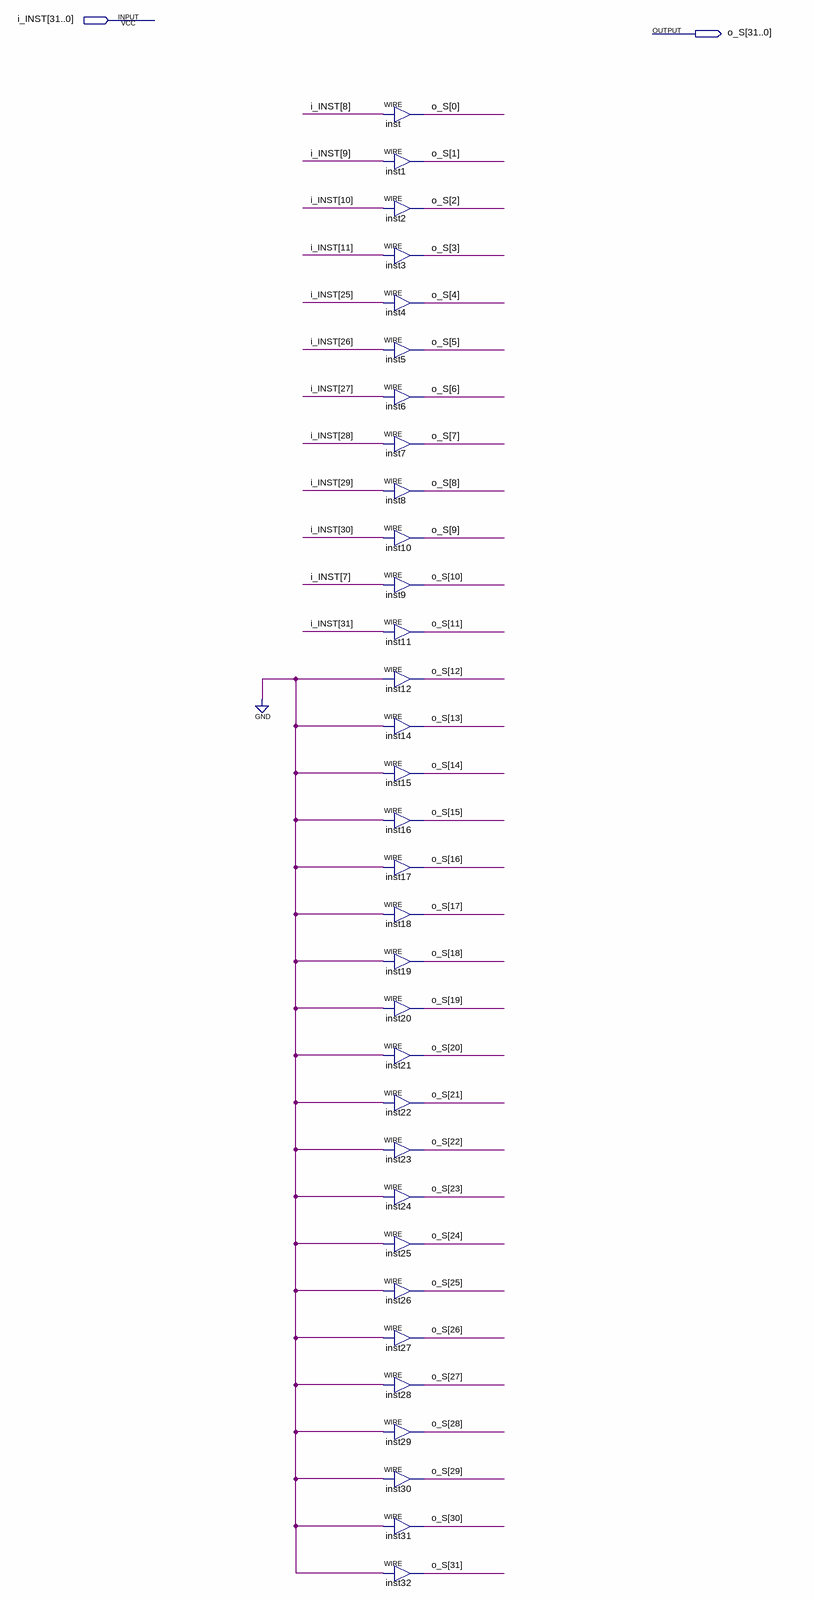
[diagram p0: schematic sheet]
// Quartus schematic organiza_imed.bdf as structural Verilog: 32 symbols, 2 pins
module organiza_imed (
  input  [31:0] i_INST,
  output [31:0] o_S
);

  assign o_S[0] = i_INST[8];  // WIRE inst
  assign o_S[1] = i_INST[9];  // WIRE inst1
  assign o_S[2] = i_INST[10];  // WIRE inst2
  assign o_S[3] = i_INST[11];  // WIRE inst3
  assign o_S[4] = i_INST[25];  // WIRE inst4
  assign o_S[5] = i_INST[26];  // WIRE inst5
  assign o_S[6] = i_INST[27];  // WIRE inst6
  assign o_S[7] = i_INST[28];  // WIRE inst7
  assign o_S[8] = i_INST[29];  // WIRE inst8
  assign o_S[9] = i_INST[30];  // WIRE inst10
  assign o_S[10] = i_INST[7];  // WIRE inst9
  assign o_S[11] = i_INST[31];  // WIRE inst11
  assign o_S[12] = 1'b0;  // WIRE inst12
  assign o_S[13] = 1'b0;  // WIRE inst14
  assign o_S[14] = 1'b0;  // WIRE inst15
  assign o_S[15] = 1'b0;  // WIRE inst16
  assign o_S[16] = 1'b0;  // WIRE inst17
  assign o_S[17] = 1'b0;  // WIRE inst18
  assign o_S[18] = 1'b0;  // WIRE inst19
  assign o_S[19] = 1'b0;  // WIRE inst20
  assign o_S[20] = 1'b0;  // WIRE inst21
  assign o_S[21] = 1'b0;  // WIRE inst22
  assign o_S[22] = 1'b0;  // WIRE inst23
  assign o_S[23] = 1'b0;  // WIRE inst24
  assign o_S[24] = 1'b0;  // WIRE inst25
  assign o_S[25] = 1'b0;  // WIRE inst26
  assign o_S[26] = 1'b0;  // WIRE inst27
  assign o_S[27] = 1'b0;  // WIRE inst28
  assign o_S[28] = 1'b0;  // WIRE inst29
  assign o_S[29] = 1'b0;  // WIRE inst30
  assign o_S[30] = 1'b0;  // WIRE inst31
  assign o_S[31] = 1'b0;  // WIRE inst32
endmodule
